# Altium project CONTOR.PrjPcb
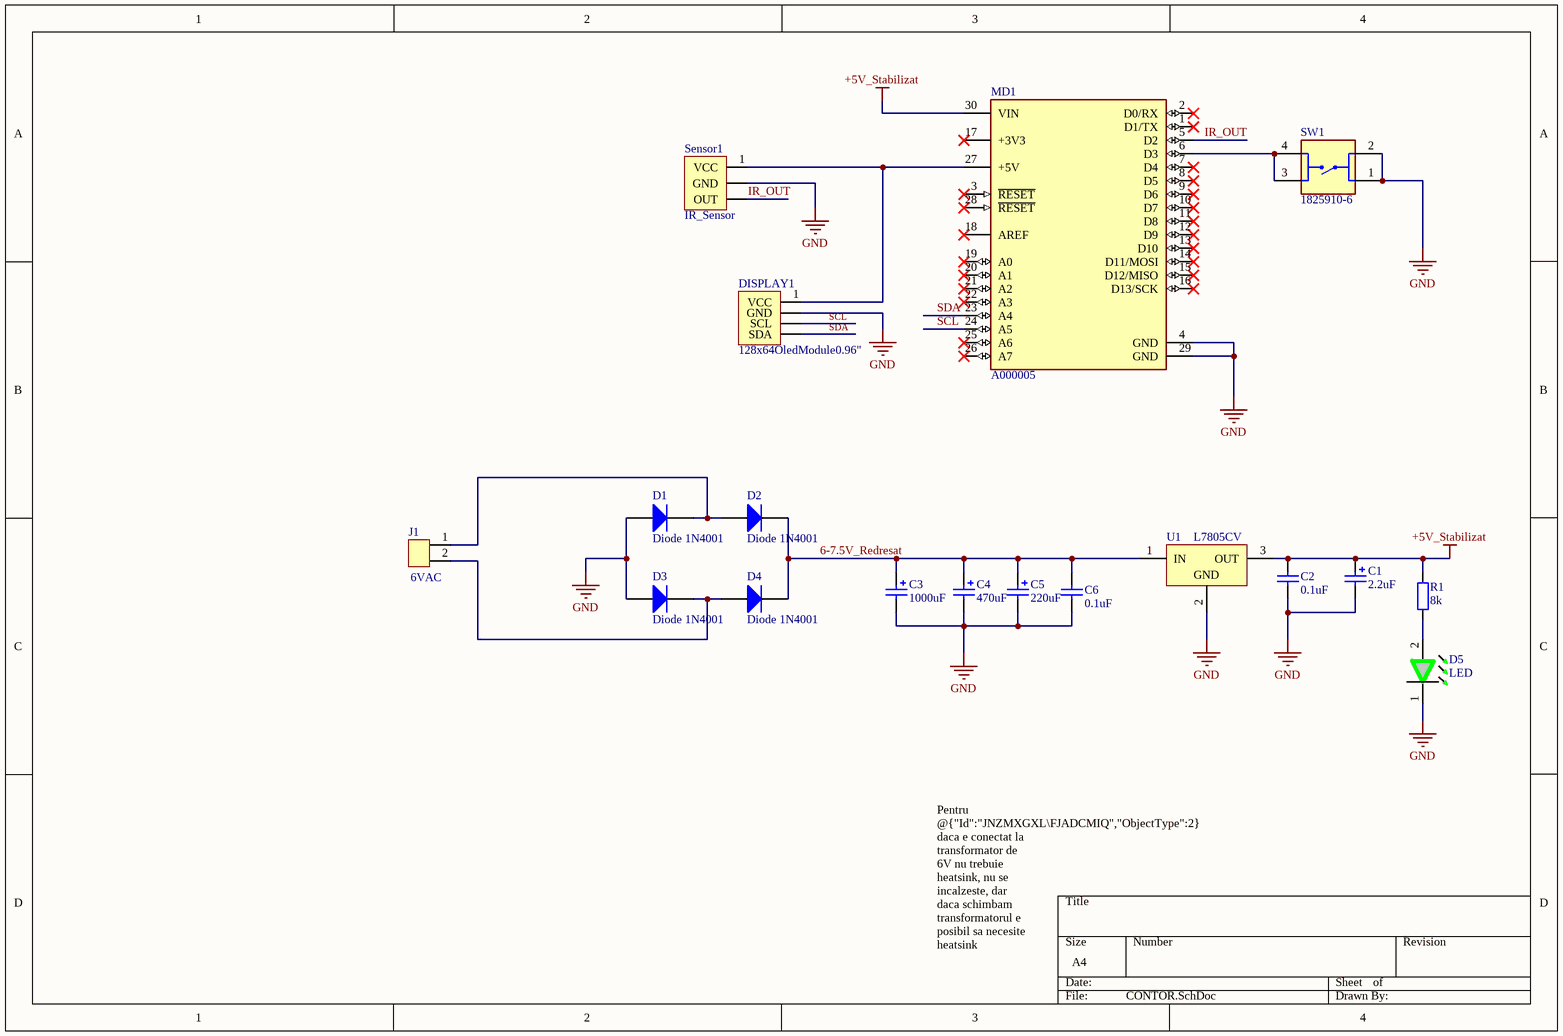
[diagram p0: CONTOR.SchDoc]
1 sheet, 18 parts. Net scope: global (net labels, ports and power ports of the same name join across sheets).
Board file: CONTOR.PcbDoc

## Sheet CONTOR.SchDoc
size A4; SheetNumber: 1; SheetTotal: 1

### Parts
C1  2.2uF  [CAPPR 220uF 3mm_pin 8mmcase]
C2  0.1uF  [CAP104 0.1uF 3mm_pin]
C3  1000uF  [CAPPR 1000uF 5mm_pin 13mmcase]
C4  470uF  [CAPPR 470uF 5mm_pin 10mmcase]
C5  220uF  [CAPPR 220uF 3mm_pin 8mmcase]
C6  0.1uF  [CAP104 0.1uF 3mm_pin]
D1  Diode 1N4001  [DO-41]
D2  Diode 1N4001  [DO-41]
D3  Diode 1N4001  [DO-41]
D4  Diode 1N4001  [DO-41]
D5  LED  [LED]
DISPLAY1  128x64OledModule0.96"  [Oled Display]
J1  6VAC  [HDR_1X2_TE]
MD1  A000005  [FP-A000005-MFG]
R1  8k  [Resistor_1/4W]
Sensor1  IR_Sensor  [SENSOR IR]
SW1  1825910-6  [SW_1825910-6-4]
U1  L7805CV  [TO220]

### Nets
+5V_Stabilizat: C1.1 C2.1 MD1.30(VIN) R1.2 U1.3(OUT)
GND: C1.2 C2.2 C3.2 C4.2 C5.2 C6.2 D1.1(A) D3.1(A) D5.1 DISPLAY1.2(GND) MD1.4(GND) MD1.29(GND) Sensor1.2(GND) SW1.1 SW1.2 U1.2(GND)
6-7.5V_Redresat: C3.1 C4.1 C5.1 C6.1 D2.2(K) D4.2(K) U1.1(IN)
IR_OUT: MD1.5(D2) Sensor1.3(OUT)
SCL: DISPLAY1.3(SCL) MD1.24(A5)
SDA: DISPLAY1.4(SDA) MD1.23(A4)
NetD1_2: D1.2(K) D2.1(A) J1.1
NetD3_2: D3.2(K) D4.1(A) J1.2
NetD5_2: D5.2 R1.1
NetDISPLAY1_1: DISPLAY1.1(VCC) MD1.27(+5V) Sensor1.1(VCC)
NetMD1_6: MD1.6(D3) SW1.3 SW1.4

Not connected (* = marked no-connect by the designer): MD1 1(D1/TX)* 2(D0/RX)* 3(~{RESET})* 7(D4)* 8(D5)* 9(D6)* 10(D7)* 11(D8)* 12(D9)* 13(D10)* 14(D11/MOSI)* 15(D12/MISO)* 16(D13/SCK)* 17(+3V3)* 18(AREF)* 19(A0)* 20(A1)* 21(A2)* 22(A3)* 25(A6)* 26(A7)* 28(~{RESET})*

### Notes on the sheet
- Pentru @{"Id":"JNZMXGXL\FJADCMIQ","ObjectType":2} daca e conectat la transformator de 6V nu trebuie heatsink, nu se incalzeste, dar daca schimbam transformatorul e posibil sa necesite heatsink

### Library data of the parts
C1 = 2.2uF Cap: Polarized Capacitor (Radial); Published: 8-Jun-2000; LatestRevisionDate: 17-Jul-2002; LatestRevisionNote: Re-released for DXP Platform.; PackageReference: RB7.6-15; Publisher: Altium Limited; PackageDescription: Polarized Capacitor (Radial); 2 Leads
C2 C6 = CAP: 104 cap
C3 = 1000uF Cap: Polarized Capacitor (Radial); Published: 8-Jun-2000; LatestRevisionDate: 17-Jul-2002; LatestRevisionNote: Re-released for DXP Platform.; PackageReference: RB7.6-15; Publisher: Altium Limited; PackageDescription: Polarized Capacitor (Radial); 2 Leads
C4 = 470uF Cap: Polarized Capacitor (Radial); Published: 8-Jun-2000; LatestRevisionDate: 17-Jul-2002; LatestRevisionNote: Re-released for DXP Platform.; PackageReference: RB7.6-15; Publisher: Altium Limited; PackageDescription: Polarized Capacitor (Radial); 2 Leads
C5 = 220uF Cap: Polarized Capacitor (Radial); Published: 8-Jun-2000; LatestRevisionDate: 17-Jul-2002; LatestRevisionNote: Re-released for DXP Platform.; PackageReference: RB7.6-15; Publisher: Altium Limited; PackageDescription: Polarized Capacitor (Radial); 2 Leads
D1-D4 = Diode 1N4001: 1 Amp General Purpose Rectifier; Published: 8-Jun-2000; LatestRevisionDate: 17-Jul-2002; LatestRevisionNote: Re-released for DXP Platform.; DatasheetVersion: 1998; PackageVersion: Aug-1999; PackageReference: DO-41; Publisher: Altium Limited; PackageDescription: Diode, Axial; Body 5.2 x 2.7 mm (LxDia. max), Lead Dia. 0.86 mm (max); Code_JEDEC: DO-204-AL; ComponentLink1Description: Manufacturer Link; ComponentLink1URL: http://www.fairchildsemi.com/; ComponentLink2Description: Datasheet; ComponentLink2URL: http://www.fairchildsemi.com/ds/1N%2F1N4001.pdf
DISPLAY1 = 0.96INCH_OLED_DISPLAY: OLED 4 Pin 128*64 Display Module 0.96” Blue Color
J1 = CON_1x2: Connector, 2-Ports
MD1 = CMP-189986-000002-1: ARDUINO NANO ATMEGA328 EVAL BRD; Number of Bits: 8; Evaluation Kit: Yes; Operating Supply Voltage: 12V; Interface: I2C; Data Bus Width: 8b; Core Architecture: AVR; Packaging: Bulk; Length: 7inch; Package Quantity: 50; Width: 5inch; REACH SVHC: No SVHC; Weight: 0.358383oz; Series: AVR® ATmega; Height: 0.25inch
R1 = Resistor 0.25W 5mm: 0.25W,Axial
SW1 = 1825910-6: Switch Push Button OFF (ON) SPST Round Button 0.05A 24VDC Momentary Contact PC Pins Thru-Hole; MF: TE Connectivity; Value: *; MP: 1825910-6; Package: None; Check_prices: https://www.snapeda.com/parts/1825910-6/TE+Connectivity+ALCOSWITCH+Switches/view-part/?ref=eda; SnapEDA_Link: https://www.snapeda.com/parts/1825910-6/TE+Connectivity+ALCOSWITCH+Switches/view-part/?ref=snap; Digi-Key_Part_Number: 450-1650-ND; Purchase-URL: https://pricing.snapeda.com/search/part/1825910-6/?ref=eda
U1 = CMP-0244-00483-1: Positive Voltage Regulator, 5V, 3-Pin TO-220; PackageDescription: TO, Thru-Hole, Vertical, Heatsink Mounted; 3 In-Line Leads; Pitch 2.54 mm; ComponentLink2Description: Datasheet; PackageReference: TO220; ComponentLink3URL: http://www.st.com/internet/com/TECHNICAL_RESOURCES/TECHNICAL_LITERATURE/PACKAGE_INFORMATION/CD00004649.pdf; DatasheetVersion: 16/11/2011; ComponentLink1Description: Manufacturer URL; ComponentLink1URL: http://www.st.com; PackageVersion: ver3.0; ComponentLink3Description: Package Specification; ComponentLink2URL: http://www.st.com/internet/com/TECHNICAL_RESOURCES/TECHNICAL_LITERATURE/DATASHEET/CD00000444.pdf